# Altium schematic sheet Sheet1.SchDoc: Mach thu phat IR
size A4; DrawnBy: Thanh
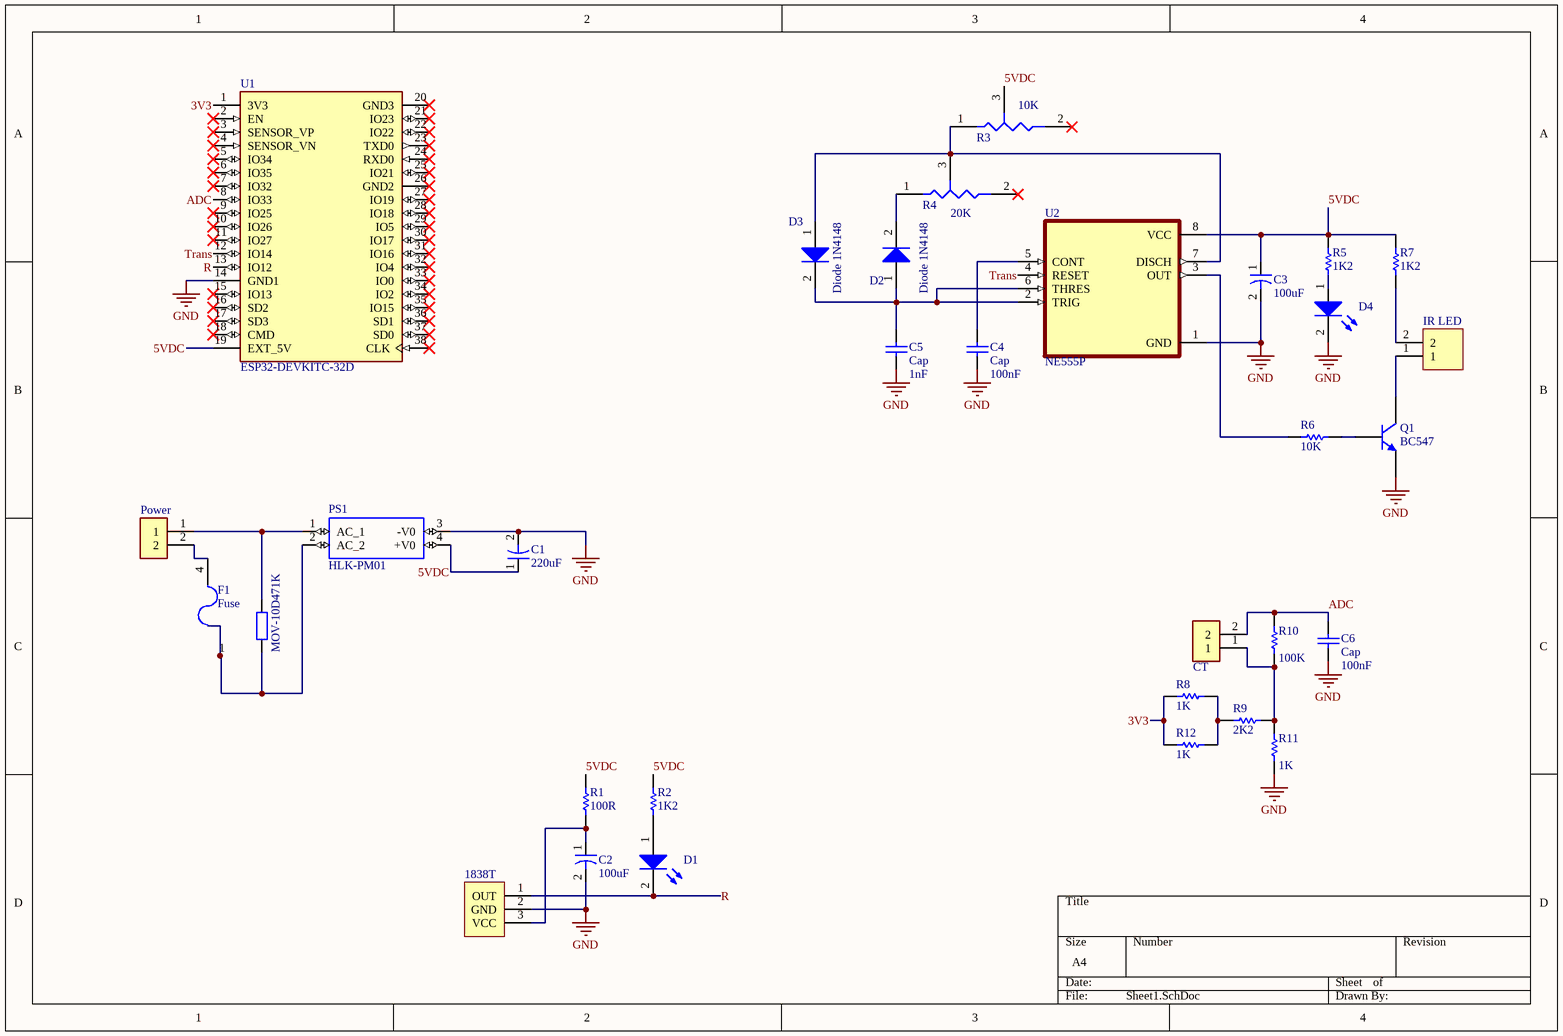
[diagram p0: Sheet1.SchDoc]

## Parts
1838T  Header 3  [TSOP 1838T]  (value not drawn)
C1  value 220uF  [CAPR5-4X5]  (hidden comment: Cap2)
C2  value 100uF  [CAPR5-4X5]  (hidden comment: Cap2)
C3  value 100uF  [CAPR5-4X5]  (hidden comment: Cap2)
C4  Cap  value 100nF  [RAD-0.3]
C5  Cap  value 1nF  [RAD-0.3]
C6  Cap  value 100nF  [RAD-0.3]
CT  282837-2  [TE_282837-2]  (value not drawn)
D1  LED  [LED]  (value not drawn)
D2  Diode 1N4148  [Diode]
D3  Diode 1N4148  [Diode]
D4  LED  [LED]  (value not drawn)
F1  Fuse  [Fuse Holder]
IR_LED  Header 2  [HDR1X2]  (value not drawn)
MOV-10D471K  (no value)  [AXIAL-0.4]
Power  282837-2  [TE_282837-2]  (value not drawn)
PS1  HLK-PM01  [HLKPM01]
Q1  BC547  [TO-226-AA]
R1  value 100R  [AXIAL-0.3]  (hidden comment: Res1)
R2  value 1K2  [AXIAL-0.3]  (hidden comment: Res1)
R3  value 10K  [Bien tro tam giac]  (hidden comment: Res Tap)
R4  value 20K  [Bien tro tam giac]  (hidden comment: Res Tap)
R5  value 1K2  [AXIAL-0.3]  (hidden comment: Res1)
R6  value 10K  [AXIAL-0.3]  (hidden comment: Res1)
R7  value 1K2  [AXIAL-0.3]  (hidden comment: Res1)
R8  value 1K  [AXIAL-0.3]  (hidden comment: Res1)
R9  value 2K2  [AXIAL-0.3]  (hidden comment: Res1)
R10  value 100K  [AXIAL-0.3]  (hidden comment: Res1)
R11  value 1K  [AXIAL-0.3]  (hidden comment: Res1)
R12  value 1K  [AXIAL-0.3]  (hidden comment: Res1)
U1  ESP32-DEVKITC-32D  [MODULE_ESP32-DEVKITC-32D]
U2  NE555P  [NE555 SOP]

## Nets
GND: 1838T.2(GND) C1.2 C2.2 C3.2 C4.1 C5.1 C6.1 D4.2(K) PS1.3(-V0) Q1.3(E) R11.1 U1.14(GND1) U2.1(GND)
3V3: R8.2 R12.2 U1.1(3V3)
5VDC: C1.1 C3.1 PS1.4(+V0) R1.2 R2.2 R3.3(TAP) R5.1 R7.2 U1.19(EXT_5V) U2.8(VCC)
ADC: C6.2 CT.2 R10.2 U1.8(IO33)
R: 1838T.1(OUT) D1.2(K) U1.13(IO12)
Trans: U1.12(IO14) U2.4(RESET)
Net1838T_3: 1838T.3(VCC) C2.1 R1.1
NetC4_2: C4.2 U2.5(CONT)
NetC5_2: C5.2 D2.1(A) D3.2(K) U2.2(TRIG) U2.6(THRES)
NetCT_1: CT.1 R9.1 R10.1 R11.2
NetD1_1: D1.1(A) R2.1
NetD2_2: D2.2(K) R4.1(A)
NetD3_1: D3.1(A) R3.1(A) R4.3(TAP) U2.7(DISCH)
NetD4_1: D4.1(A) R5.2
NetF1_1: F1.1 MOV-10D471K.1 PS1.2(AC_2)
NetF1_4: F1.4 Power.2
NetIR_LED_1: IR_LED.1 Q1.1(C)
NetIR_LED_2: IR_LED.2 R7.1
NetMOV-10D471K_2: MOV-10D471K.2 Power.1 PS1.1(AC_1)
NetQ1_2: Q1.2(B) R6.2
NetR6_1: R6.1 U2.3(OUT)
NetR8_1: R8.1 R9.2 R12.1

Not connected (* = marked no-connect by the designer): R3 2(B)*; R4 2(B)*; U1 2(EN)* 3(SENSOR_VP)* 4(SENSOR_VN)* 5(IO34)* 6(IO35)* 7(IO32)* 9(IO25)* 10(IO26)* 11(IO27)* 15(IO13)* 16(SD2)* 17(SD3)* 18(CMD)* 20(GND3)* 21(IO23)* 22(IO22)* 23(TXD0)* 24(RXD0)* 25(IO21)* 26(GND2)* 27(IO19)* 28(IO18)* 29(IO5)* 30(IO17)* 31(IO16)* 32(IO4)* 33(IO0)* 34(IO2)* 35(IO15)* 36(SD1)* 37(SD0)* 38(CLK)*

## Library data of the parts
1838T = Header 3: Header, 3-Pin; LatestRevisionDate: 17-Jul-2002; LatestRevisionNote: Re-released for DXP Platform.; Publisher: Altium Limited
C1-C3 = Cap2: Capacitor; Published: 23-Sep-2002; PackageReference: CAPR5-4X5; Publisher: Altium Limited; PackageDescription: Capacitor; 2 Leads
C4-C6 = Cap: Capacitor; Published: 8-Jun-2000; LatestRevisionDate: 17-Jul-2002; LatestRevisionNote: Re-released for DXP Platform.; PackageReference: RAD-0.3; Publisher: Altium Limited; PackageDescription: Radial Cap, Thru-Hole; 2 Leads; 0.3 in Pin Spacing
CT Power = 282837-2: Connector Terminal Blocks Receptacle 2 Position 5.08mm Solder Straight Thru-Hole 13.5A/Contact; MF: TE Connectivity; Digi-Key_Purchase_URL: https://www.digikey.in/product-detail/en/te-connectivity-amp-connectors/282837-2/A113320-ND/2187973?utm_source=snapeda&utm_medium=aggregator&utm_campaign=symbol; Value: *; TE_purchase_URL: https://www.te.com/usa-en/product-282837-2.html?te_bu=Cor&te_type=disp&te_campaign=seda_glo_cor-seda-global-disp-prtnr-fy19-seda-model-bom-cta_sma-317_1&elqCampaignId=32493; Package: None; MP: 282837-2; SnapEDA_Link: https://www.snapeda.com/parts/282837-2/TE%20Connectivity%20AMP%20Connectors/view-part/2549980/?ref=snap; Digi-Key_Part_Number: A113320-ND; Comment_1: *
D1 D4 = LED0: Typical INFRARED GaAs LED; Published: 8-Jun-2000; LatestRevisionDate: 08-Jul-2005; LatestRevisionNote: Mech Layer 1 removed.; PackageReference: LED-0; Publisher: Altium Limited; PackageDescription: LED; 2 Leads
D2 D3 = Diode 1N4448: High Conductance Fast Diode; Published: 8-Jun-2000; LatestRevisionDate: 17-Jul-2002; LatestRevisionNote: Re-released for DXP Platform.; DatasheetVersion: 1997; PackageReference: DO-35; Publisher: Altium Limited; PackageDescription: Diode, Axial; Body 3.8 x 1.9 mm (LxDia. max), Lead Dia. 0.53 mm (max); Code_JEDEC: DO-204-AH; ComponentLink1Description: Manufacturer Link; ComponentLink1URL: http://www.fairchildsemi.com/; ComponentLink2Description: Datasheet; ComponentLink2URL: http://www.fairchildsemi.com/ds/1N%2F1N4448.pdf
F1 = Fuse 2: Published: 8-Jun-2000; LatestRevisionDate: 17-Jul-2002; LatestRevisionNote: Re-released for DXP Platform.; PackageReference: PIN-W2/E2.8; Publisher: Altium Limited; PackageDescription: Thru-Hole; 2 Leads
IR_LED = Header 2: Header, 2-Pin; LatestRevisionDate: 17-Jul-2002; LatestRevisionNote: Re-released for DXP Platform.; Publisher: Altium Limited
MOV-10D471K = Res2: Resistor; Value: 1K; Published: 8-Jun-2000; LatestRevisionDate: 17-Jul-2002; LatestRevisionNote: Re-released for DXP Platform.; PackageReference: AXIAL-0.4; Publisher: Altium Limited; PackageDescription: Axial Device, Thru-Hole; 2 Leads; 0.4 in Pin Spacing
PS1 = HLK-PM01: <b>Ultra-compact power module</b><p> Source: <a href="https://datasheet.lcsc.com/szlcsc/1906201102_HI-LINK-HLK-PM03_C209904.pdf"> Datasheet </a>; Package: Package Analog Devices; MF: Hi-link; Availability: Unavailable; Value: *; MP: hlk-pm01; Price: None; SnapEDA_Link: https://www.snapeda.com/parts/hlk-pm01/Hi-link/view-part/2875605/?ref=snap
Q1 = NPN: NPN Bipolar Transistor; Published: 8-Jun-2000; LatestRevisionDate: 17-Jul-2002; LatestRevisionNote: Re-released for DXP Platform.; PackageReference: TO-226-AA; Publisher: Altium Limited; PackageDescription: TO, Flat Index; 3 In-Line, Axial Leads; Body Dia. 4.8mm; Leads 0.55 x 0.51 mm (max); Code_JEDEC: TO-226-AA
R1 R2 R5-R12 = Res1: Resistor; Published: 8-Jun-2000; LatestRevisionDate: 17-Jul-2002; LatestRevisionNote: Re-released for DXP Platform.; PackageReference: AXIAL-0.3; Publisher: Altium Limited; PackageDescription: Axial Device, Thru-Hole; 2 Leads; 0.3 in Pin Spacing
R3 R4 = Res Tap: Tapped Resistor; Sim Note: Enter the Resistance value and the set point into parameter fields.; Set Position: 0.5; Published: 24-Mar-1999; LatestRevisionDate: 17-Jul-2002; LatestRevisionNote: Re-released for DXP Platform.; PackageReference: VR3; Publisher: Altium Limited; PackageDescription: Variable Resistor, Thru-Hole; 3 Leads
U1 = ESP32-DEVKITC-32D: - Transceiver; 802.11 b/g/n _Wi-Fi, WiFi, WLAN_, BluetoothÂ® Smart Ready 4.x Dual Mode For Use With ESP-WROOM-32; MF: Espressif Systems; Package: None; Price: None; Availability: Unavailable; MP: ESP32-DEVKITC-32D; SnapEDA_Link: https://www.snapeda.com/parts/ESP32-DEVKITC-32D/Espressif%20Systems/view-part/2777395/?ref=snap; Value: *
U2 = NE555P: Single Precision Timer; MF: Texas Instruments; Package: PDIP-8 Texas Instruments; Value: *; MP: NE555P; Texas_Instruments-Purchase-URL: https://snapeda.com/shop?store=Texas+Instruments&id=2776400; Arrow_Electronics-Purchase-URL: https://snapeda.com/shop?store=Arrow+Electronics&id=2776400; Mouser-Purchase-URL: https://snapeda.com/shop?store=Mouser&id=2776400; DigiKey-Purchase-URL: https://snapeda.com/shop?store=DigiKey&id=2776400; SnapEDA_Link: https://www.snapeda.com/parts/NE555P/Texas%20Instruments/view-part/2776400/?ref=snap